# EAGLE design V05 (EAGLE 7.1.0)
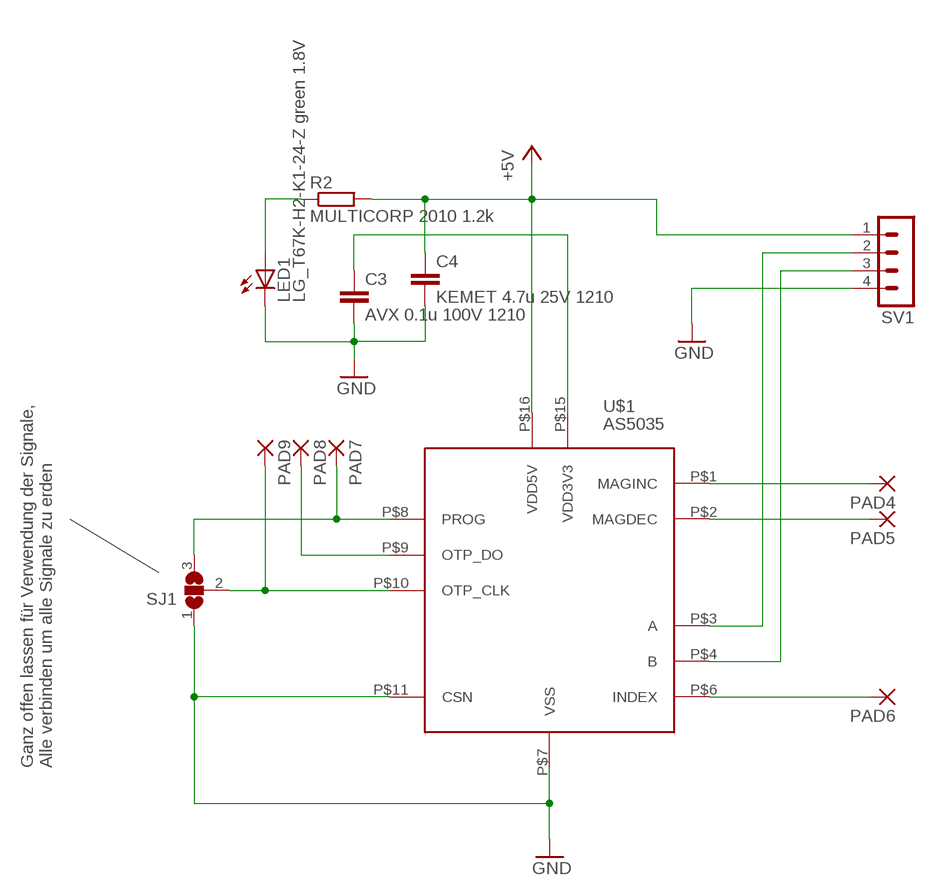
[diagram p0: schematic, sheet 1]

## Parts
C3  AVX 0.1u 100V 1210  C-EUC1210  [C1210]
C4  KEMET 4.7u 25V 1210  C-EUC1210  [C1210]
LED1  LG_T67K-H2-K1-24-Z green 1.8V  LG_T679-E1F1-1  [PLCC2]
PAD4  1,6/0,8  [1,6/0,8]
PAD5  1,6/0,8  [1,6/0,8]
PAD6  1,6/0,8  [1,6/0,8]
PAD7  1,6/0,8  [1,6/0,8]
PAD8  1,6/0,8  [1,6/0,8]
PAD9  1,6/0,8  [1,6/0,8]
R2  MULTICORP 2010 1.2k  R-EU_R2010  [R2010]
SJ1  SJ2W  [SJ_2]
SV1  MA04-1  [MA04-1]
U$1  AS5035  [TSSOP-16]

## Nets
+5V: C4.1 R2.2 SV1.1 U$1.P$16(VDD5V)
GND: C3.2 C4.2 LED1.C SJ1.1 SV1.4 U$1.P$7(VSS) U$1.P$11(CSN)
N$1: C3.1 U$1.P$15(VDD3V3)
N$2: PAD4.1(P) U$1.P$1(MAGINC)
N$3: PAD5.1(P) U$1.P$2(MAGDEC)
N$4: PAD6.1(P) U$1.P$6(INDEX)
N$5: PAD9.1(P) SJ1.2 U$1.P$10(OTP_CLK)
N$6: LED1.A R2.1
N$7: SV1.3 U$1.P$4(B)
N$8: SV1.2 U$1.P$3(A)
N$9: PAD7.1(P) SJ1.3 U$1.P$8(PROG)
N$10: PAD8.1(P) U$1.P$9(OTP_DO)

## Notes on the sheet
- Ganz offen lassen für Verwendung der Signale,
  Alle verbinden um alle Signale zu erden

## Library data of the parts
C3 C4 = rcl:C-EU: CAPACITOR, European symbol
LED1 = led:*_T679-?-1: LC TOPLED® Low Current LED Source: http://catalog.osram-os.com .. LG_LS_LY_T679_OBS.pdf; COLOR: green
PAD4-PAD9 = wirepad:1,6/0,8: THROUGH-HOLE PAD
R2 = rcl:R-EU_: RESISTOR, European symbol
SJ1 = jumper:SJ2W: SMD solder JUMPER
SV1 = con-lstb:MA04-1: PIN HEADER; OC_FARNELL: unknown; OC_NEWARK: unknown
U$1 = keysie:AS5035

## Board
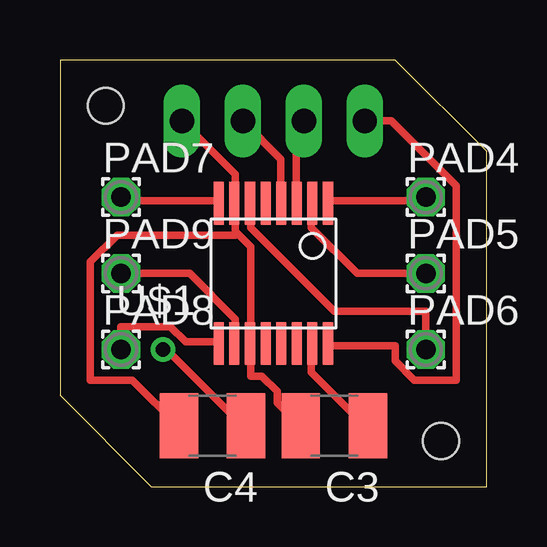
[diagram p1: board, top side]
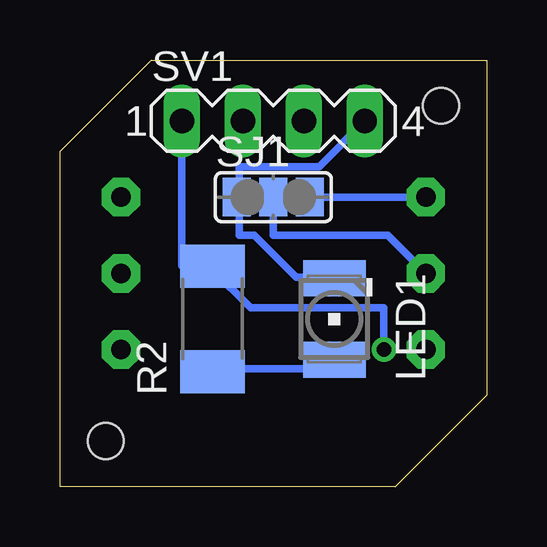
[diagram p2: board, bottom side, seen from below]

Size 17.78 x 17.78 mm. Coordinates in mm from the lower left corner, seen from the top.
Outline: 3.81,0 17.78,0 17.78,13.97 13.97,17.78 0,17.78 0,3.81 3.81,0
Copper layers (1*16): Top 0.035mm / dielectric 1.5mm / Bottom 0.035mm
Design rules "default *": minimum track width 12mil, minimum drill 24mil, track to track 8mil, track to pad 8mil, pad to pad 8mil, via to via 8mil, smd to smd 8mil, copper to edge 40mil, drill to drill 8mil, minimum pad ring 10mil, minimum via ring 8mil, stop-mask expansion 4mil, vias tented up to drill 0mil, thermal gap 10mil
Holes 1.5 mm at 15.88,1.91 1.91,15.88

### Footprints (pad centres in the part's own frame; a part is rotated, then mirrored left to right if it is on the bottom)
C1210 = smd 1.6 x 2.7: 1 -1.4,0; 2 1.4,0
PLCC2 = smd 2.6 x 1.5: A 0,1.7; C 0,-1.7
1,6/0,8 = drill 0.813 pad 1.6 octagon: 1 0,0
R2010 = smd 1.8 x 2.7: 1 -2.2,0; 2 2.2,0
SJ_2 = smd 1.168 x 1.6: 1 -1.524,0; 2 0,0; 3 1.524,0
MA04-1 = drill 1.016 long: 1 -3.81,0; 2 -1.27,0; 3 1.27,0; 4 3.81,0
TSSOP-16 = smd 0.42 x 1.78: P$1 -2.275,-2.925; P$2 -1.625,-2.925; P$3 -0.975,-2.925; P$4 -0.325,-2.925; P$5 0.325,-2.925; P$6 0.975,-2.925; P$7 1.625,-2.925; P$8 2.275,-2.925; P$9 2.275,2.925; P$10 1.625,2.925; P$11 0.975,2.925; P$12 0.325,2.925; P$13 -0.325,2.925; P$14 -0.975,2.925; P$15 -1.625,2.925; P$16 -2.275,2.925

### Placement (x,y rotation side)
C3  11.43,2.54 180 top
C4  6.35,2.54 180 top
LED1  6.35,6.99 180 bottom
PAD4  15.24,12.06 0 top
PAD5  15.24,8.89 0 top
PAD6  15.24,5.71 0 top
PAD7  2.54,12.06 0 top
PAD8  2.54,5.71 0 top
PAD9  2.54,8.89 0 top
R2  11.43,6.99 90 bottom
SJ1  8.89,12.06 0 bottom
SV1  8.89,15.24 0 bottom
U$1  8.89,8.89 180 top

### Tracks (layer width: path | path; a pad name or v marks a point on that pad's centre or on a via)
+5V  (via drill 0.61)
  Top 0.305: SV1.1 13.81,15.24 16.51,12.54 16.51,4.45 14.76,4.45 13.97,5.24 13.97,5.87 11.27,5.87 U$1.P$16 | v4.29,5.71 4.45,5.71 7.62,2.54 C4.1
  Bottom 0.305: v4.29,5.71 4.29,7.46 9.84,7.46 11.43,9.05 R2.2 11.43,9.21 12.7,9.21 SV1.1
GND
  Top 0.305: SV1.4 7.3,13.02 7.3,11.91 U$1.P$7 7.3,11.75 7.3,10.64 7.38,10.56 | 7.38,10.56 7.94,10 7.94,6.03 U$1.P$11 7.94,5.87 7.94,4.6 8.41,4.6 9.05,3.97 9.05,3.49 10,2.54 C3.2 | C4.2 4.92,2.54 3.02,4.45 1.27,4.45 1.27,9.37 2.38,10.48 7.3,10.48 7.38,10.56
  Bottom 0.305: 10.32,12.06 10.32,10.48 9.68,10.48 7.94,8.73 6.35,8.73 LED1.C | 10.32,12.06 10.32,13.34 6.99,13.34 SV1.4 | 10.32,12.06 SJ1.1
N$1
  Top 0.305: U$1.P$15 10.48,5.87 10.48,4.76 12.7,2.54 C3.1
N$2
  Top 0.305: PAD4.1 15.24,11.91 11.27,11.91 U$1.P$1
N$3
  Top 0.305: PAD5.1 12.38,8.89 10.48,10.79 10.48,11.75 U$1.P$2
N$4
  Top 0.305: PAD6.1 15.24,7.3 11.43,7.3 7.94,10.79 7.94,11.75 U$1.P$6
N$5
  Top 0.305: PAD9.1 5.4,8.89 7.3,6.99 7.3,6.03 U$1.P$10
  Bottom 0.305: SJ1.2 8.89,10.48 4.13,10.48 PAD9.1
N$6
  Bottom 0.305: LED1.A 6.35,5.24 6.67,4.92 11.43,4.92 R2.1
N$7
  Top 0.305: SV1.3 9.21,13.65 9.21,11.91 U$1.P$4
N$8
  Top 0.305: SV1.2 9.84,14.92 9.84,11.91 U$1.P$3
N$9
  Top 0.305: PAD7.1 2.54,11.91 6.51,11.91 U$1.P$8
  Bottom 0.305: PAD7.1 SJ1.3
N$10
  Top 0.305: PAD8.1 2.54,6.67 4.6,6.67 5.24,6.03 6.51,6.03 U$1.P$9